# Altium schematic sheet BOOST.SchDoc
size Legal; Author: Mark & Qiming; DocumentNumber: 9; SheetNumber: 8; SheetTotal: 9
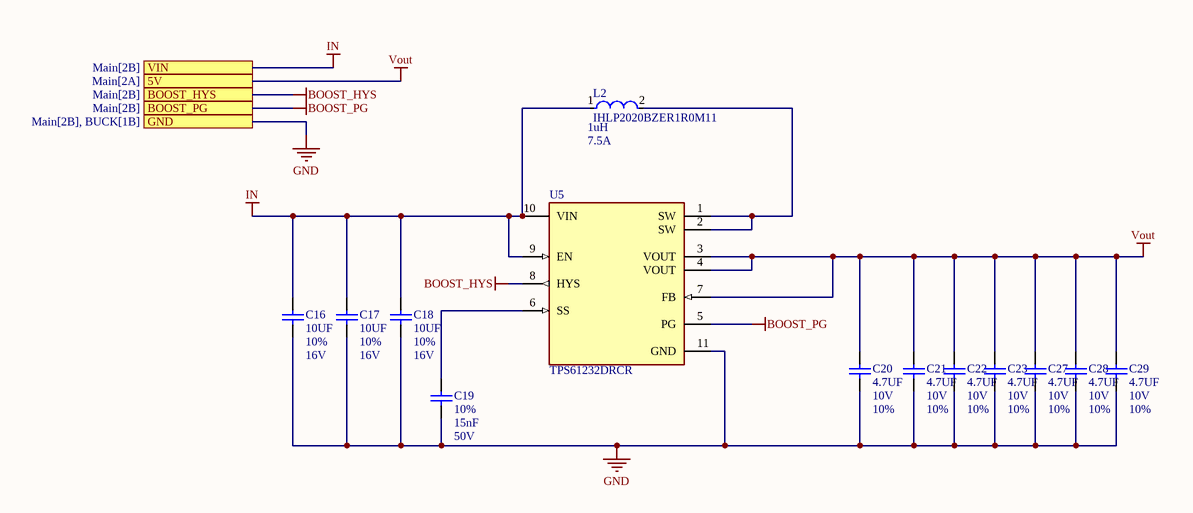
[diagram p0: BOOST.SchDoc]

## Parts
C16  value 10UF  Tolerance: 10%  Voltage: 16V  [1206_CAP]  (hidden comment: CAP 1206 10UF 16V 10% X7R)
C17  value 10UF  Tolerance: 10%  Voltage: 16V  [1206_CAP]  (hidden comment: CAP 1206 10UF 16V 10% X7R)
C18  value 10UF  Tolerance: 10%  Voltage: 16V  [1206_CAP]  (hidden comment: CAP 1206 10UF 16V 10% X7R)
C19  value 15nF  Tolerance: 10%  Voltage: 50V  [0603_CAP]  (hidden comment: CAP 0603 1500PF 50V 10% X7R)
C20  value 4.7UF  Voltage: 10V  Tolerance: 10%  [0603_CAP]  (hidden comment: CAP 0603 4.7UF 10V 10% X5R)
C21  value 4.7UF  Voltage: 10V  Tolerance: 10%  [0603_CAP]  (hidden comment: CAP 0603 4.7UF 10V 10% X5R)
C22  value 4.7UF  Voltage: 10V  Tolerance: 10%  [0603_CAP]  (hidden comment: CAP 0603 4.7UF 10V 10% X5R)
C23  value 4.7UF  Voltage: 10V  Tolerance: 10%  [0603_CAP]  (hidden comment: CAP 0603 4.7UF 10V 10% X5R)
C27  value 4.7UF  Voltage: 10V  Tolerance: 10%  [0603_CAP]  (hidden comment: CAP 0603 4.7UF 10V 10% X5R)
C28  value 4.7UF  Voltage: 10V  Tolerance: 10%  [0603_CAP]  (hidden comment: CAP 0603 4.7UF 10V 10% X5R)
C29  value 4.7UF  Voltage: 10V  Tolerance: 10%  [0603_CAP]  (hidden comment: CAP 0603 4.7UF 10V 10% X5R)
L2  IHLP2020BZER1R0M11  Current Rating: 7.5A  Inductance: 1uH  [FP-IHLP-2020BZ-FP_1_905x2-MFG]
U5  TPS61232DRCR  [FP-DRC0010G-IPC_A]

## Ports
5V (see Main[2A]), BOOST_HYS (see Main[2B]), BOOST_PG (see Main[2B]), GND (see Main[2B], BUCK[1B]), VIN (see Main[2B])

## Nets
BOOST_HYS: U5.8(HYS) ; port BOOST_HYS
BOOST_PG: U5.5(PG) ; port BOOST_PG
GND: C16.1 C17.1 C18.1 C19.1 C20.1 C21.1 C22.1 C23.1 C27.1 C28.1 C29.1 U5.11(GND) ; port GND
IN: C16.2 C17.2 C18.2 L2.1 U5.9(EN) U5.10(VIN) ; port VIN
Vout: C20.2 C21.2 C22.2 C23.2 C27.2 C28.2 C29.2 U5.3(VOUT) U5.4(VOUT) U5.7(FB) ; port 5V
NetC19_2: C19.2 U5.6(SS)
NetL2_2: L2.2 U5.1(SW) U5.2(SW)

## Notes on the sheet
- Title:
- Desc:
- Size:
- Letter
- Auth:
- Proj:
- Sheet
- of
- www.seas.upenn.edu
- Electrical and Systems Engineering

## Library data of the parts
C16-C18 = CMP-011-000639-1: Capacitor Surface Mount 1206 Footprint 10UF 16V 10% Tolerance Ceramic X7R; Manufacturer: Various; PCB Package: 1206; Description in Visual: Cap SMT 1206 10UF 16V 10%  Cer X7R; Type: Ceramic X7R; Mount: SMT; P/N: CAP 1206 10UF 16V 10% X7R; Manufacturer P/N: CAP 1206 10UF 16V 10% X7R
C19 = CMP-011-000275-1: Capacitor Surface Mount 0603 Footprint 1500PF 50V 10% Tolerance Ceramic X7R; Manufacturer: Various; Description in Visual: Cap SMT 0603 1500PF 50V 10%  Cer X7R; PCB Package: 0603; Manufacturer P/N: CAP 0603 1500PF 50V 10% X7R; Mount: SMT; Type: Ceramic X7R; P/N: CAP 0603 1500PF 50V 10% X7R
C20-C23 C27-C29 = CMP-011-000329-1: Capacitor Surface Mount 0603 Footprint 4.7UF 10V 10% Tolerance Ceramic X5R; Manufacturer: Various; PCB Package: 0603; Description in Visual: Cap SMT 0603 4.7UF 10V 10%  Cer X5R; Mount: SMT; Type: Ceramic X5R; P/N: CAP 0603 4.7UF 10V 10% X5R; Manufacturer P/N: CAP 0603 4.7UF 10V 10% X5R
L2 = CMP-02424-000397-1: Fixed Inductors Commercial Low DCR Series 1uH 7.5A 18.1mΩ 20%; Saturation Current: 7A; Test Frequency: 100kHz; Shielding: Shielded; Self Resonant Frequency: 1MHz; DC Resistance (DCR): 18.1mR; Inductance Tolerance: 20%; Min Operating Temperature: -55°C; Depth: 5.43mm; Case/Package: 2020; Package Quantity: 2000; Tolerance: 20%; Length: 5.74mm; Military Standard: Not; Height - Seated (Max): 0.079inch; Width: 0.204inch; Max Operating Temperature: 125°C; Lead Free: Lead Free; Radiation Hardening: No; Contact Plating: Tin; Max DC Current: 7A; Packaging: Tape and Reel; RMS Current (Irms): 7.5A; Mount: Surface Mount; Height: 2mm; Termination: SMD/SMT
U5 = CMP-04918-000377-1: IC REG BOOST 5V 4A 10VSON; Max Input Voltage: 5.5V; Quiescent Current: 35uA; Min Input Voltage: 2.3V; Max Output Current: 2.1A; Number of Outputs: 1; Switching Frequency: 2MHz; Efficiency: 96%; Output Type: Fixed; Lead Free: Lead Free; Min Operating Temperature: -40°C; RoHS Compliant: Yes; Output Voltage: 5V; Number of Pins: 10; Max Operating Temperature: 85°C; Contact Plating: Gold; Topology: Boost; Mount: Surface Mount; Operating Supply Voltage: 5.5V